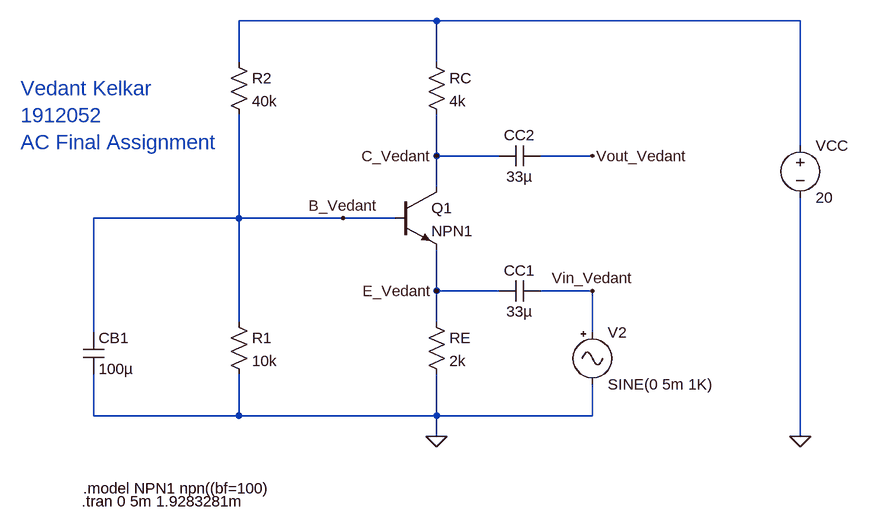
[diagram p0: schematic Draft38.asc]
Draft38.asc, the LTspice schematic file:
Version 4
SHEET 1 936 680
WIRE 304 -208 0 -208
WIRE 864 -208 304 -208
WIRE 0 -144 0 -208
WIRE 304 -144 304 -208
WIRE 864 -16 864 -208
WIRE 304 0 304 -64
WIRE 400 0 304 0
WIRE 544 0 464 0
WIRE 304 48 304 0
WIRE 0 96 0 -64
WIRE 0 96 -224 96
WIRE 160 96 0 96
WIRE 240 96 160 96
WIRE 304 208 304 144
WIRE 400 208 304 208
WIRE 544 208 464 208
WIRE 0 256 0 96
WIRE 304 256 304 208
WIRE -224 272 -224 96
WIRE 544 272 544 208
WIRE -224 400 -224 336
WIRE 0 400 0 336
WIRE 0 400 -224 400
WIRE 304 400 304 336
WIRE 304 400 0 400
WIRE 544 400 544 352
WIRE 544 400 304 400
WIRE 304 432 304 400
WIRE 864 432 864 64
FLAG 304 0 C_Vedant
FLAG 304 208 E_Vedant
FLAG 864 432 0
FLAG 304 432 0
FLAG 544 0 Vout_Vedant
FLAG 160 96 B_Vedant
FLAG 544 208 Vin_Vedant
SYMBOL res -16 240 R0
SYMATTR InstName R1
SYMATTR Value 10k
SYMBOL cap -240 272 R0
SYMATTR InstName CB1
SYMATTR Value 100µ
SYMBOL res -16 -160 R0
SYMATTR InstName R2
SYMATTR Value 40k
SYMBOL res 288 240 R0
SYMATTR InstName RE
SYMATTR Value 2k
SYMBOL res 288 -160 R0
SYMATTR InstName RC
SYMATTR Value 4k
SYMBOL npn 240 48 R0
SYMATTR InstName Q1
SYMATTR Value NPN1
SYMBOL cap 464 -16 R90
WINDOW 0 0 32 VBottom 2
WINDOW 3 32 32 VTop 2
SYMATTR InstName CC2
SYMATTR Value 33µ
SYMBOL cap 464 192 R90
WINDOW 0 0 32 VBottom 2
WINDOW 3 32 32 VTop 2
SYMATTR InstName CC1
SYMATTR Value 33µ
SYMBOL voltage 864 -32 R0
WINDOW 123 0 0 Left 0
WINDOW 39 0 0 Left 0
SYMATTR InstName VCC
SYMATTR Value 20
SYMBOL Misc\\signal 544 256 R0
WINDOW 123 0 0 Left 0
WINDOW 39 0 0 Left 0
SYMATTR InstName V2
SYMATTR Value SINE(0 5m 1K)
TEXT -240 512 Left 2 !.model NPN1 npn((bf=100)
TEXT -242 532 Left 2 !.tran 0 5m 1.9283281m
TEXT -336 -104 Left 3 ;Vedant Kelkar \n1912052\nAC Final Assignment

The netlist it stands for:
* Draft38.asc
R1 B_Vedant 0 10k
CB1 B_Vedant 0 100µ
R2 N001 B_Vedant 40k
RE E_Vedant 0 2k
RC N001 C_Vedant 4k
Q1 C_Vedant B_Vedant E_Vedant 0 NPN1
CC2 Vout_Vedant C_Vedant 33µ
CC1 Vin_Vedant E_Vedant 33µ
VCC N001 0 20
V2 Vin_Vedant 0 SINE(0 5m 1K)
.model NPN NPN
.model PNP PNP
.lib standard.bjt
.model NPN1 npn((bf=100)
.tran 0 5m 1.9283281m
* Vedant Kelkar
* 1912052
* AC Final Assignment
.backanno
.end